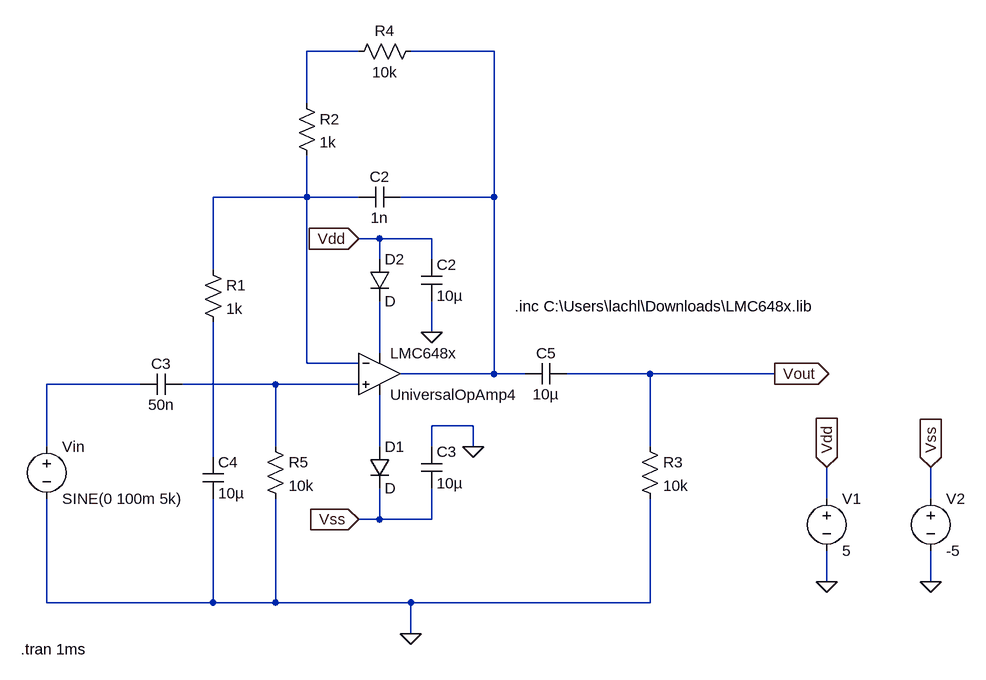
[diagram p0: schematic Draft2.asc]
Draft2.asc, the LTspice schematic file:
Version 4.1
SHEET 1 2276 680
WIRE 640 -544 560 -544
WIRE 848 -544 720 -544
WIRE 560 -464 560 -544
WIRE 560 -320 560 -384
WIRE 560 -320 416 -320
WIRE 640 -320 560 -320
WIRE 848 -320 848 -544
WIRE 848 -320 704 -320
WIRE 672 -256 640 -256
WIRE 752 -256 672 -256
WIRE 672 -224 672 -256
WIRE 752 -224 752 -256
WIRE 416 -208 416 -320
WIRE 752 -112 752 -160
WIRE 672 -80 672 -160
WIRE 560 -64 560 -320
WIRE 640 -64 560 -64
WIRE 848 -48 848 -320
WIRE 848 -48 704 -48
WIRE 896 -48 848 -48
WIRE 1088 -48 960 -48
WIRE 1280 -48 1088 -48
WIRE 304 -32 160 -32
WIRE 512 -32 368 -32
WIRE 640 -32 512 -32
WIRE 816 32 752 32
WIRE 160 64 160 -32
WIRE 512 64 512 -32
WIRE 672 64 672 -16
WIRE 752 64 752 32
WIRE 816 64 816 32
WIRE 1088 64 1088 -48
WIRE 416 80 416 -128
WIRE 1360 144 1360 96
WIRE 1520 144 1520 96
WIRE 672 176 672 128
WIRE 672 176 640 176
WIRE 752 176 752 128
WIRE 752 176 672 176
WIRE 1360 272 1360 224
WIRE 1520 272 1520 224
WIRE 160 304 160 144
WIRE 416 304 416 144
WIRE 416 304 160 304
WIRE 512 304 512 144
WIRE 512 304 416 304
WIRE 720 304 512 304
WIRE 1088 304 1088 144
WIRE 1088 304 720 304
WIRE 720 352 720 304
FLAG 1280 -48 Vout
IOPIN 1280 -48 Out
FLAG 640 -256 Vdd
IOPIN 640 -256 In
FLAG 640 176 Vss
IOPIN 640 176 In
FLAG 720 352 0
FLAG 816 64 0
FLAG 752 -112 0
FLAG 1520 272 0
FLAG 1360 272 0
FLAG 1520 96 Vss
IOPIN 1520 96 In
FLAG 1360 96 Vdd
IOPIN 1360 96 In
SYMBOL voltage 160 48 R0
WINDOW 123 0 0 Left 0
WINDOW 39 0 0 Left 0
SYMATTR InstName Vin
SYMATTR Value SINE(0 100m 5k)
SYMBOL cap 368 -48 R90
WINDOW 0 0 32 VBottom 2
WINDOW 3 32 32 VTop 2
SYMATTR InstName C3
SYMATTR Value 50n
SYMBOL res 496 48 R0
SYMATTR InstName R5
SYMATTR Value 10k
SYMBOL diode 656 64 R0
SYMATTR InstName D1
SYMBOL diode 656 -224 R0
SYMATTR InstName D2
SYMBOL cap 736 -224 R0
SYMATTR InstName C2
SYMATTR Value 10µ
SYMBOL cap 736 64 R0
SYMATTR InstName C3
SYMATTR Value 10µ
SYMBOL cap 960 -64 R90
WINDOW 0 0 32 VBottom 2
WINDOW 3 32 32 VTop 2
SYMATTR InstName C5
SYMATTR Value 10µ
SYMBOL res 1072 48 R0
SYMATTR InstName R3
SYMATTR Value 10k
SYMBOL cap 704 -336 R90
WINDOW 0 0 32 VBottom 2
WINDOW 3 32 32 VTop 2
SYMATTR InstName C2
SYMATTR Value 1n
SYMBOL res 544 -480 R0
SYMATTR InstName R2
SYMATTR Value 1k
SYMBOL cap 400 80 R0
SYMATTR InstName C4
SYMATTR Value 10µ
SYMBOL res 400 -224 R0
SYMATTR InstName R1
SYMATTR Value 1k
SYMBOL res 736 -560 R90
WINDOW 0 0 56 VBottom 2
WINDOW 3 32 56 VTop 2
SYMATTR InstName R4
SYMATTR Value 10k
SYMBOL voltage 1360 128 R0
WINDOW 123 0 0 Left 0
WINDOW 39 0 0 Left 0
SYMATTR InstName V1
SYMATTR Value 5
SYMBOL voltage 1520 128 R0
SYMATTR InstName V2
SYMATTR Value -5
SYMBOL OpAmps\\UniversalOpAmp4 672 -48 R0
SYMATTR InstName LMC648x
TEXT 880 -152 Left 2 !.inc C:\\Users\\lachl\\Downloads\\LMC648x.lib
TEXT 120 376 Left 2 !.tran 1ms

The netlist it stands for:
* Draft2.asc
Vin N005 0 SINE(0 100m 5k)
C3 N006 N005 50n
R5 N006 0 10k
D1 N007 Vss D
D2 Vdd N004 D
C2 Vdd 0 10µ
C3 0 Vss 10µ
C5 Vout N002 10µ
R3 Vout 0 10k
C2 N002 N003 1n
R2 N001 N003 1k
C4 N008 0 10µ
R1 N003 N008 1k
R4 N002 N001 10k
V1 Vdd 0 5
V2 Vss 0 -5
* LMC648x: UniversalOpAmp4 (symbol OpAmps\UniversalOpAmp4 not available, pins judged from their places): In+=N006 In-=N003 V+=N004 V-=N007 OUT=N002
.model D D
.lib standard.dio
.inc C:\Users\lachl\Downloads\LMC648x.lib
.tran 1ms
.backanno
.end